# Altium schematic sheet WirelessDrivers.SchDoc
size A4; Organization: HSLU T&A; Address1: Abteilung Elektrotechnik; Address2: Technikumsstrasse 21; Address3: CH-6048 Horw
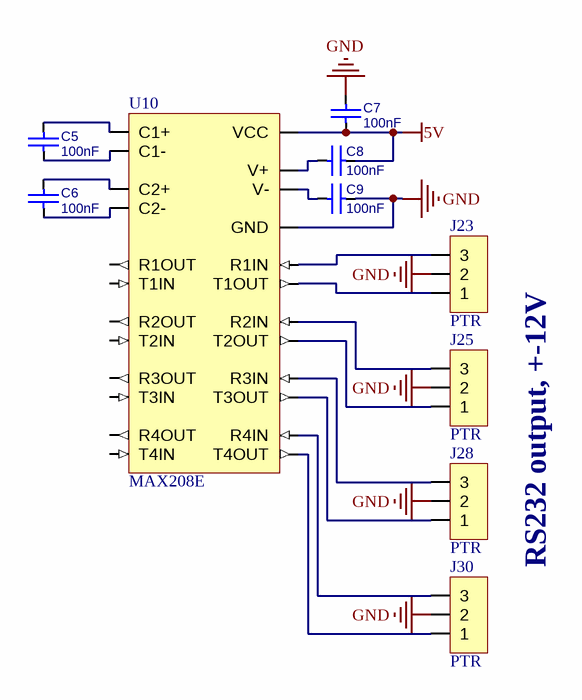
[diagram p0: WirelessDrivers.SchDoc]

## Parts
C5  100nF  [0603]
C6  100nF  [0603]
C7  100nF  [0603]
C8  100nF  [0603]
C9  100nF  [0603]
J23  PTR  [PTR_1X3]
J25  PTR  [PTR_1X3]
J28  PTR  [PTR_1X3]
J30  PTR  [PTR_1X3]
U10  MAX208E  [SSOP24]

## Nets
5V: C7.1 C8.1 U10.9(VCC)
GND: C7.2 C9.1 J23.2 J25.2 J28.2 J30.2 U10.8(GND)
NetC5_1: C5.1 U10.12(C1-)
NetC5_2: C5.2 U10.10(C1+)
NetC6_1: C6.1 U10.14(C2-)
NetC6_2: C6.2 U10.13(C2+)
NetC8_2: C8.2 U10.11(V+)
NetC9_2: C9.2 U10.15(V-)
NetJ23_1: J23.1 U10.2(T1OUT)
NetJ23_3: J23.3 U10.7(R1IN)
NetJ25_1: J25.1 U10.1(T2OUT)
NetJ25_3: J25.3 U10.3(R2IN)
NetJ28_1: J28.1 U10.24(T3OUT)
NetJ28_3: J28.3 U10.23(R3IN)
NetJ30_1: J30.1 U10.20(T4OUT)
NetJ30_3: J30.3 U10.16(R4IN)

Not connected (* = marked no-connect by the designer): U10 4(R2OUT) 5(T1IN) 6(R1OUT) 17(R4OUT) 18(T2IN) 19(T3IN) 21(T4IN) 22(R3OUT)

## Notes on the sheet
- RS232 output, +-12V
- Project:
- Drawn by:
- Size:
- Sheet
- A3
- Rev.:
- of
- Date:
- File:

## Library data of the parts
C5-C9 = 4: Keramikkondensator 0603; Changed by: taalbiss; Number of pads: 2; Part ID: 4; Category: Capacitors - Ceramic; Distributor: Mouser; Distributor Order Number: 0; ComponentLink1URL: http://www.mouser.ch/Passive-Components/Capacitors/Ceramic-Capacitors/MLCCs-Multilayer-Ceramic-Capacitors/Multilayer-Ceramic-Capacitors-MLCC-SMD-SMT/_/N-bkrdv?P=1yzmou6; ComponentLink1Description: Mouser 0603 Ceramic Capacitors; Price: 0; Changed at: 21.07.2015 17:44:32; SMD: True
J23 J25 J28 J30 = Header_1x3: Distributor: Distrelec; Distributor Order Number: STLZ1550/03-3.81-H
U10 = MAX208E: Distributor Order Number: 700-MAX208ECAG; Distributor: Mouser